# EAGLE design master-board (EAGLE 8.7.0)
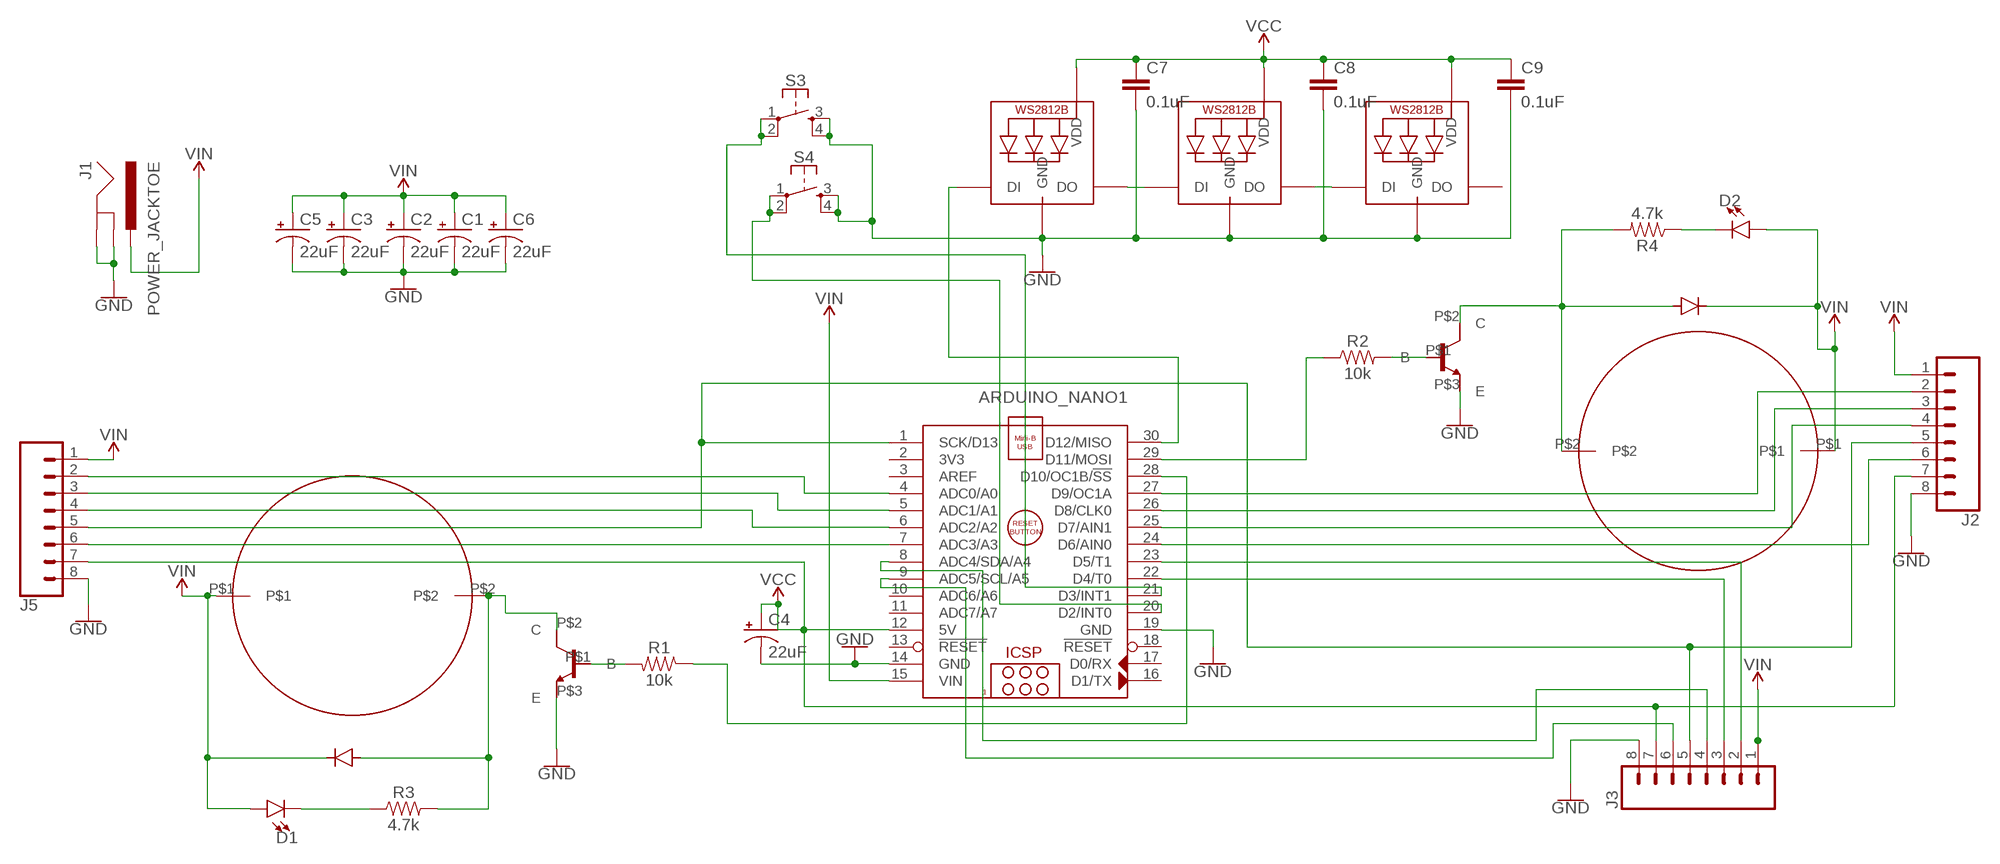
[diagram p0: schematic, sheet 1]

## Parts
ARDUINO_NANO1  ARDUINO_NANO  [ARDUINO_NANO]
C1  22uF  22UF-POLAR-PANASONIC_C-35V-20%  [PANASONIC_C]
C2  22uF  22UF-POLAR-PANASONIC_C-35V-20%  [PANASONIC_C]
C3  22uF  22UF-POLAR-PANASONIC_C-35V-20%  [PANASONIC_C]
C4  22uF  22UF-POLAR-PANASONIC_C-35V-20%  [PANASONIC_C]
C5  22uF  22UF-POLAR-PANASONIC_C-35V-20%  [PANASONIC_C]
C6  22uF  22UF-POLAR-PANASONIC_C-35V-20%  [PANASONIC_C]
C7  0.1uF  0.1UF-0603-25V-(+80/-20%)  [0603]
C8  0.1uF  0.1UF-0603-25V-(+80/-20%)  [0603]
C9  0.1uF  0.1UF-0603-25V-(+80/-20%)  [0603]
D1  LED0603  [LED-0603]
D2  LED0603  [LED-0603]
J1  POWER_JACKTOE  [POWER_JACK_SMD_OVERPASTE_TOE]
J2  CONN_08"  [1X08]
J3  CONN_08"  [1X08]
J5  CONN_08"  [1X08]
LED1  WS2812B5050  [WS2812B]
LED2  WS2812B5050  [WS2812B]
LED3  WS2812B5050  [WS2812B]
R1  10k  10KOHM-0603-1/10W-1%  [0603]
R2  10k  10KOHM-0603-1/10W-1%  [0603]
R3  4.7k  4.7KOHM-0603-1/10W-1%  [0603]
R4  4.7k  4.7KOHM-0603-1/10W-1%  [0603]
S3  MOMENTARY-SWITCH-SPST-2-SMD-4.6X2.8MM  [TACTILE_SWITCH_SMD_4.6X2.8MM]
S4  MOMENTARY-SWITCH-SPST-2-SMD-4.6X2.8MM  [TACTILE_SWITCH_SMD_4.6X2.8MM]
U$1  AIYIMA-PUMP-A5F083  [A5F083]
U$2  AIYIMA-PUMP-A5F083  [A5F083]
U$3  IN4148  [IN4148]
U$4  IN4148  [IN4148]
U$5  TIP120-TO220  [TO220]
U$6  TIP120-TO220  [TO220]

## Nets
GND: ARDUINO_NANO1.14(GND) ARDUINO_NANO1.19(GND) C1.- C2.- C3.- C4.- C5.- C6.- C7.2 C8.2 C9.2 J1.GND(GNDBREAK) J1.P$4(GND) J2.8 J3.8 J5.8 LED1.3-GND(GND) LED2.3-GND(GND) LED3.3-GND(GND) S3.3 S3.4 S4.3 S4.4 U$5.P$3(E) U$6.P$3(E)
N$1: ARDUINO_NANO1.29(D11/MOSI) R2.1
N$2: R1.2 U$6.P$1(B)
N$3: ARDUINO_NANO1.23(D5/T1) J3.2
N$4: ARDUINO_NANO1.22(D4/T0) J3.3
N$5: R3.2 U$1.P$2 U$3.P$2 U$6.P$2(C)
N$6: R4.2 U$2.P$2 U$4.P$2 U$5.P$2(C)
N$7: R2.2 U$5.P$1(B)
N$8: ARDUINO_NANO1.30(D12/MISO) LED1.4-DIN(DI)
N$9: ARDUINO_NANO1.8(ADC4/SDA/A4) J3.4
N$10: ARDUINO_NANO1.28(D10/OC1B/!SS) R1.1
N$11: ARDUINO_NANO1.5(ADC1/A1) J5.3
N$12: D1.C R3.1
N$13: ARDUINO_NANO1.1(SCK/D13) J2.5 J3.5 J5.5
N$14: ARDUINO_NANO1.7(ADC3/A3) J5.6
N$15: ARDUINO_NANO1.9(ADC5/SCL/A5) J3.6
N$16: ARDUINO_NANO1.4(ADC0/A0) J5.2
N$17: D2.C R4.1
N$18: ARDUINO_NANO1.6(ADC2/A2) J5.4
N$20: ARDUINO_NANO1.20(D2/INT0) S4.1 S4.2
N$21: LED2.2-DOUT(DO) LED3.4-DIN(DI)
N$22: ARDUINO_NANO1.24(D6/AIN0) J2.6
N$23: ARDUINO_NANO1.25(D7/AIN1) J2.4
N$24: ARDUINO_NANO1.26(D8/CLK0) J2.3
N$25: ARDUINO_NANO1.27(D9/OC1A) J2.2
N$26: LED1.2-DOUT(DO) LED2.4-DIN(DI)
N$29: ARDUINO_NANO1.21(D3/INT1) S3.1 S3.2
VCC: ARDUINO_NANO1.12(5V) C4.+ C7.1 C8.1 C9.1 J2.7 J3.7 J5.7 LED1.1-VDD(VDD) LED2.1-VDD(VDD) LED3.1-VDD(VDD)
VIN: ARDUINO_NANO1.15(VIN) C1.+ C2.+ C3.+ C5.+ C6.+ D1.A D2.A J1.VIN0(PWR) J2.1 J3.1 J5.1 U$1.P$1 U$2.P$1 U$3.P$1 U$4.P$1
Unconnected: ARDUINO_NANO1.2(3V3) ARDUINO_NANO1.3(AREF) ARDUINO_NANO1.10(ADC6/A6) ARDUINO_NANO1.11(ADC7/A7) ARDUINO_NANO1.13(!RESET) ARDUINO_NANO1.16(D1/TX) ARDUINO_NANO1.17(D0/RX) ARDUINO_NANO1.18(!RESET) LED3.2-DOUT(DO)

## Library data of the parts
ARDUINO_NANO1 = ArduinoNanoV30:ARDUINO_NANO: Arduino Nano V3.0 Module Overview: The Arduino Nano is a small, complete, and breadboard-friendly board based on the ATmega328 (Arduino Nano 3.x) or ATmega168 (Arduino Nano 2.x). It has more or less the same functionality of the Arduino Duemilanove, but in a different package. It lacks only a DC power jack, and works with a Mini-B USB cable instead of a standard one. The Nano was designed and is being produced by Gravitech <http://www.gravitech.us/arna30wiatp.html>. General specifications: Item Value Microcontroller Atmel ATmega168 or ATmega328 Operating Voltage (logic level) 5 V Input Voltage (recommended) 7-12 V Input Voltage (limits) 6-20 V Digital I/O Pins 14 (of which 6 provide PWM output) Analog Input Pins 8 DC Current per I/O Pin 40 mA Flash Memory 16 KB (ATmega168) or 32 KB (ATmega328) of which 2 KB used by bootloader SRAM 1 KB (ATmega168) or 2 KB (ATmega328) EEPROM 512 bytes (ATmega168) or 1 KB (ATmega328) Clock Speed 16 MHz Dimensions (Inches) 0.73" x 1.70" Dimensions (mm) 18mm x 45mm Overall height About 9 mm (not including pins) Weigth 5 g Power: The Arduino Nano can be powered via the Mini-B USB connection, 6-20V unregulated external power supply (pin 30), or 5V regulated external power supply (pin 27). The power source is automatically selected to the highest voltage source. Memory: The ATmega168 has 16 KB of flash memory for storing code (of which 2 KB is used for the bootloader); the ATmega328 has 32 KB, (also with 2 KB used for the bootloader). The ATmega168 has 1 KB of SRAM and 512 bytes of EEPROM (which can be read and written with the EEPROM library); the ATmega328 has 2 KB of SRAM and 1 KB of EEPROM. Input and Output: Each of the 14 digital pins on the Nano can be used as an input or output, using pinMode(), digitalWrite(), and digitalRead() functions. They operate at 5 volts. Each pin can provide or receive a maximum of 40 mA and has an internal pull-up resistor (disconnected by default) of 20-50 kOhms. In addition, some pins have specialized functions. Visit Arduino - ArduinoBoardNano <https://www.arduino.cc/en/Main/ArduinoBoardNano>
C1-C6 = SparkFun-Capacitors:22UF-POLAR: 22µF polarized capacitors A capacitor is a passive two-terminal electrical component used to store electrical energy temporarily in an electric field.; PROD_ID: CAP-08618
C7-C9 = SparkFun-Capacitors:0.1UF: 0.1µF ceramic capacitors A capacitor is a passive two-terminal electrical component used to store electrical energy temporarily in an electric field.; PROD_ID: CAP-00810
D1 D2 = SparkFun-LED:LED: LED (Generic) Standard schematic elements and footprints for 5mm, 3mm, 1206, and 0603 sized LEDs. Generic LEDs with no color specified.
J1 = SparkFun-Connectors:POWER_JACK: Power Jack Connector This is the standard 5.5mm barrel jack for power. The PTH is the most common, proven, reliable, footprint. The Slot footprint only works if the mill layer is transmitted to the PCB fab house so be warned. Here are the connectors we sell at SparkFun: DC Barrel Power Jack/Connector <https://www.sparkfun.com/products/119> (PRT-00119) DC Barrel Power Jack/Connector (SMD) <https://www.sparkfun.com/products/12748> (PRT-12748) DC Barrel Jack Adapter - Breadboard Compatible <https://www.sparkfun.com/products/10811> (PRT-10811) It is used on this SparkFun product (and many, many others): SparkFun RedBoard - Programmed with Arduino <https://www.sparkfun.com/products/12757> (DEV-12757) Also, if you need a mating power supply or connector, please check these out: Wall Adapter Power Supply - 9VDC 650mA <https://www.sparkfun.com/products/298> (TOL-00298) DC Barrel Jack Adapter - Male <https://www.sparkfun.com/products/10287> (PRT-10287); PROD_ID: CONN-08106; SF_ID: PRT-12748
J2 J3 J5 = SparkFun-Connectors:CONN_08: Multi connection point. Often used as Generic Header-pin footprint for 0.1 inch spaced/style header connections On any of the 0.1 inch spaced packages, you can populate with these: Break Away Headers - Straight <https://www.sparkfun.com/products/116> (PRT-00116) Break Away Male Headers - Right Angle <https://www.sparkfun.com/products/553> (PRT-00553) Female Headers <https://www.sparkfun.com/products/115> (PRT-00115) Break Away Headers - Machine Pin <https://www.sparkfun.com/products/117> (PRT-00117) Break Away Female Headers - Swiss Machine Pin <https://www.sparkfun.com/products/743> (PRT-00743) Arduino Stackable Header - 8 Pin <https://www.sparkfun.com/products/9279> (PRT-09279) For SCREWTERMINALS and SPRING TERMINALS visit here: Screw Terimnals on SparkFun.com <https://www.sparkfun.com/search/results?term=Screw+Terminals> (5mm/3.5mm/2.54mm spacing) This device is also useful as a general connection point to wire up your design to another part of your project. Our various solder wires solder well into these plated through hole pads. Hook-Up Wire - Assortment (Stranded, 22 AWG) <https://www.sparkfun.com/products/11375> (PRT-11375) Hook-Up Wire - Assortment (Solid Core, 22 AWG) <https://www.sparkfun.com/products/11367> (PRT-11367) View the entire wire category on our website here <https://www.sparkfun.com/categories/141> Special notes: Molex polarized connector foot print use with SKU : PRT-08231 with associated crimp pins and housings. 1MM SMD Version SKU: PRT-10208 NOTES ON THE VARIANTS LOCK and LOCK_LONGPADS... This footprint was designed to help hold the alignment of a through-hole component (i.e. 6-pin header) while soldering it into place. You may notice that each hole has been shifted either up or down by 0.005 of an inch from it's more standard position (which is a perfectly straight line). This slight alteration caused the pins (the squares in the middle) to touch the edges of the holes. Because they are alternating, it causes a "brace" to hold the component in place. 0.005 has proven to be the perfect amount of "off-center" position when using our standard breakaway headers. Although looks a little odd when you look at the bare footprint, once you have a header in there, the alteration is very hard to notice. Also,if you push a header all the way into place, it is covered up entirely on the bottom side.; PROD_ID: CONN-08438
LED1-LED3 = adafruit:WS2812B
R1 R2 = SparkFun-Resistors:10KOHM: 10kΩ resistor A resistor is a passive two-terminal electrical component that implements electrical resistance as a circuit element. Resistors act to reduce current flow, and, at the same time, act to lower voltage levels within circuits. - Wikipedia; PROD_ID: RES-00824
R3 R4 = SparkFun-Resistors:4.7KOHM: 4.7kΩ resistor A resistor is a passive two-terminal electrical component that implements electrical resistance as a circuit element. Resistors act to reduce current flow, and, at the same time, act to lower voltage levels within circuits. - Wikipedia; PROD_ID: RES-07857
S3 S4 = SparkFun-Switches:MOMENTARY-SWITCH-SPST-2: Momentary Switch (Pushbutton) - SPST - Two Circuits Normally-open (NO) SPST momentary switches (buttons, pushbuttons). Schematic symbol includes two switch circuits. Variants SMD-4.6MMX2.8MM - 4.60mm x 2.80mm Tactile Momentary Button Switch - Used on SparkFun SAMD21 Mini Breakout <https://www.sparkfun.com/products/13664> SMD-5.2MM - Mini Pushbutton Switch - SMD <https://www.sparkfun.com/products/8720> - Used on Arduino Pro Mini <https://www.sparkfun.com/products/11114>; PROD_ID: SWCH-13065
U$1 U$2 = programmable-air-components:AIYIMA-PUMP-A5F083: Aiyima company vacuum/high pressure air pump. 12V, 0.35A, 3LPM
U$3 U$4 = programmable-air-components:IN4148
U$5 U$6 = programmable-air-components:TIP120-TO220

## Board
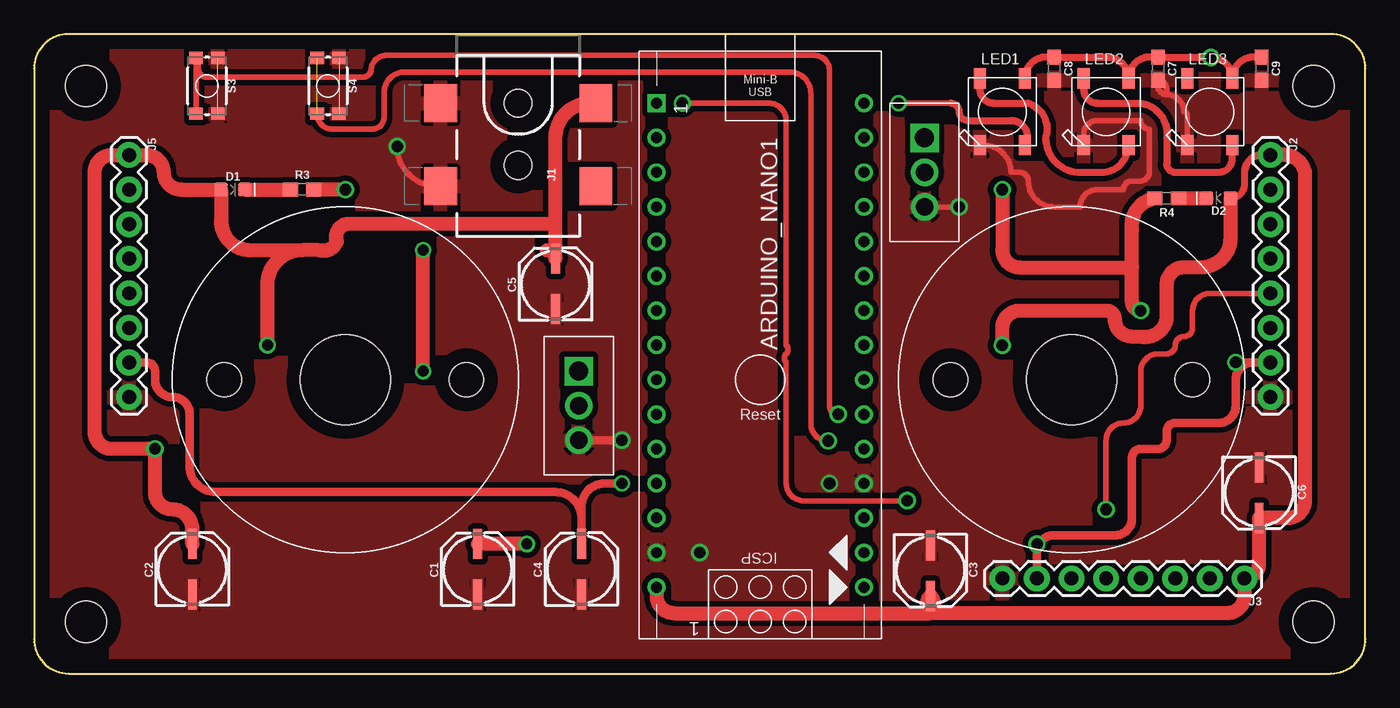
[diagram p1: board, top side]
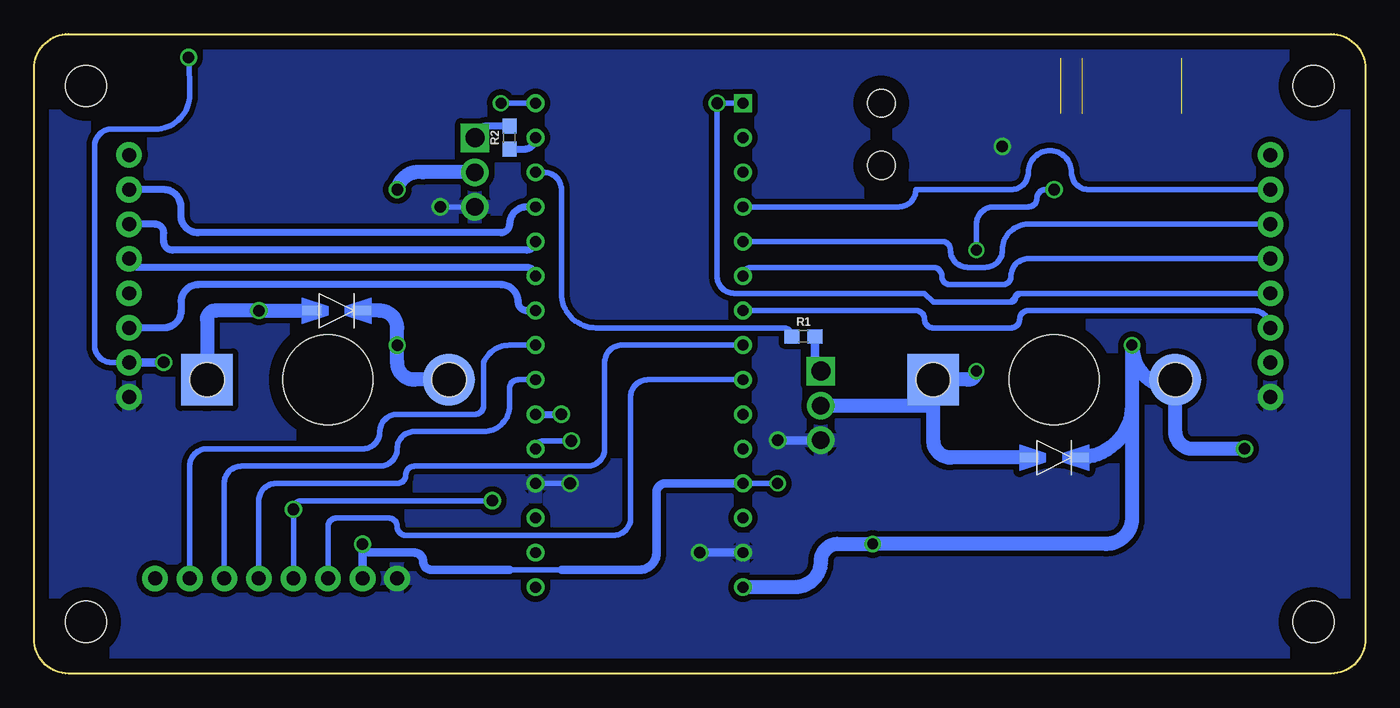
[diagram p2: board, bottom side, seen from below]

Size 97.79 x 46.99 mm. Coordinates in mm from the lower left corner, seen from the top.
Outline: 0,44.45 0,2.54 arc90 2.54,0 95.25,0 arc90 97.79,2.54 97.79,44.45 arc90 95.25,46.99 2.54,46.99 arc90 0,44.45
Copper layers (1*16): Top 0.035mm / dielectric 1.5mm / Bottom 0.035mm
Design rules "default *": minimum track width 6mil, minimum drill 0.35mm, track to track 16mil, track to pad 16mil, pad to pad 16mil, via to via 16mil, smd to smd 16mil, copper to edge 40mil, drill to drill 6mil, minimum pad ring 10mil, minimum via ring 8mil, stop-mask expansion 4mil, vias tented up to drill 0mil, thermal gap 10mil
Holes 3.05 mm at 3.81,43.18 3.81,3.81 93.98,3.81 93.98,43.18
tKeepout: area 91.4,40.6 to 97.8,47; area 91.4,0 to 97.8,6.3; area 0,40.6 to 6.3,47; area 0,0 to 6.3,6.3; area 10.2,8.9 to 35.6,34.3; area 63.5,8.9 to 88.9,34.3
bKeepout: area 0,0 to 6.3,6.3; area 0,40.6 to 6.3,47; area 91.4,40.6 to 97.8,47; area 91.4,0 to 97.8,6.3

### Footprints (pad centres in the part's own frame; a part is rotated, then mirrored left to right if it is on the bottom)
ARDUINO_NANO = drill 0.8 square: 1 -20.32,-7.62 | drill 0.8: 2 -17.78,-7.62; 3 -15.24,-7.62; 4 -12.7,-7.62; 5 -10.16,-7.62; 6 -7.62,-7.62; 7 -5.08,-7.62; 8 -2.54,-7.62; 9 0,-7.62; 10 2.54,-7.62; 11 5.08,-7.62; 12 7.62,-7.62; 13 10.16,-7.62; 14 12.7,-7.62; 15 15.24,-7.62; 16 15.24,7.62; 17 12.7,7.62; 18 10.16,7.62; 19 7.62,7.62; 20 5.08,7.62; 21 2.54,7.62; 22 0,7.62; 23 -2.54,7.62; 24 -5.08,7.62; 25 -7.62,7.62; 26 -10.16,7.62; 27 -12.7,7.62; 28 -15.24,7.62; 29 -17.78,7.62; 30 -20.32,7.62
PANASONIC_C = smd 2.2 x 0.65: + 1.9,-0.2; - -1.8,-0.2
0603 = smd 1.1 x 1: 1 -0.85,0; 2 0.85,0
LED-0603 = smd 1 x 1: A -0.877,0; C 0.877,0
POWER_JACK_SMD_OVERPASTE_TOE = smd 2.8 x 2.4: GND 0,-5.7; P$4 6.1,-5.7; VIN0 0,5.7; VIN1 6.1,5.7 | hole 2.032: 0,0; 4.572,0
1X08 = drill 1.016 pad 1.88: 1 0,0; 2 2.54,0; 3 5.08,0; 4 7.62,0; 5 10.16,0; 6 12.7,0; 7 15.24,0; 8 17.78,0
WS2812B = smd 1.5 x 0.9: 1-VDD 2.45,-1.65; 2-DOUT 2.45,1.65; 3-GND -2.45,1.65; 4-DIN -2.45,-1.65
TACTILE_SWITCH_SMD_4.6X2.8MM = smd 0.9 x 1: 1 -2.05,-0.8; 2 2.05,-0.8; 3 2.05,0.8; 4 -2.05,0.8
A5F083 = smd 3.81 x 3.81 bottom: P$1 -8.89,0; P$2 8.89,0 | hole 6.604: 0,0 | hole 2.54: -8.89,0; 8.89,0
IN4148 = smd 1.422 x 0.711: P$1 1.829,0; P$2 -1.829,0
TO220 = drill 1.397 pad 2.032 square: P$1 -2.54,0 | drill 1.27 pad 2.032: P$2 0,0; P$3 2.54,0

### Placement (x,y rotation side)
ARDUINO_NANO1  53.34,21.59 270 top
C1  32.38,7.62 90 top
C2  11.43,7.62 90 top
C3  66.04,7.62 270 top
C4  40.01,7.62 90 top
C5  38.1,28.57 90 top
C6  90.17,13.34 270 top
C7  82.55,44.45 270 top
C8  74.93,44.45 270 top
C9  90.17,44.45 270 top
D1  14.61,35.56 0 top
D2  87,34.92 180 top
J1  35.56,41.91 270 top
J2  90.81,38.1 270 top
J3  88.9,6.99 180 top
J5  6.99,38.1 270 top
LED1  71.12,41.27 90 top
LED2  78.74,41.27 90 top
LED3  86.36,41.27 90 top
R1  41.27,24.77 0 bottom
R2  62.87,39.37 90 bottom
R3  19.68,35.56 0 top
R4  83.19,34.92 180 top
S3  12.7,43.18 270 top
S4  21.59,43.18 270 top
U$1  22.86,21.59 0 top
U$2  76.2,21.59 0 top
U$3  22.86,15.88 0 bottom
U$4  75.56,26.67 0 bottom
U$5  65.41,36.83 270 top
U$6  40.01,19.68 270 top

### Tracks (layer width: path | path; a pad name or v marks a point on that pad's centre or on a via)
GND  (via drill 0.85)  (2 unrouted)
  Top 0.406: LED2.3-GND 77.09,39.62 arc-90 78.11,40.64 81.28,40.64 arc90 81.92,40.01 81.92,36.83 arc-90 81.28,36.2 80.64,36.2 arc90 80.01,35.56 78.11,35.56 arc90 76.83,34.29 74.93,34.29 arc-90 73.03,36.2 arc90 72.39,36.83 71.75,36.83 arc90 69.76,38.83 LED1.3-GND | J1.P$4 29.59,35.81 arc-90 v26.67,38.73 | LED3.3-GND 84.71,41.02 arc90 84.45,41.27 arc90 83.19,42.55 | 83.19,42.55 83.19,42.97 arc90 C7.2 82.55,43.18 arc90 83.19,42.55 | U$5.P$3 v67.94,34.29
  Top 0.508: LED2.3-GND 77.09,38.99
  Top 0.635: U$6.P$3 v43.18,17.14
  Bottom 0.406: v67.94,34.29 U$5.P$3 | ARDUINO_NANO1.19 v58.42,13.97
  Bottom 0.635: v48.9,8.89 ARDUINO_NANO1.14 | U$6.P$3 v43.18,17.14
  pour Top: 0,2.54 0,44.45 arc-90 2.54,46.99 95.25,46.99 arc-90 97.79,44.45 97.79,2.54 arc-90 95.25,0 2.54,0 arc-90
  pour Bottom: 0,44.45 0,2.54 arc90 2.54,0 95.25,0 arc90 97.79,2.54 97.79,44.45 arc90 95.25,46.99 2.54,46.99 arc90
N$1
  Bottom 0.508: R2.1 61.81,38.52 arc-90 ARDUINO_NANO1.29
N$2
  Bottom 0.635: R1.2 40.42,22.64 arc-90 U$6.P$1
N$3
  Bottom 0.406: ARDUINO_NANO1.23 62.87,24.13 arc-67 64.77,22.86 64.77,19.68 arc90 65.41,19.05 71.12,19.05 arc-90 72.39,17.78 arc90 73.66,16.51 85.09,16.51 arc-90 86.36,15.24 J3.2
N$4
  Bottom 0.406: J3.3 83.82,13.97 arc90 82.55,15.24 72.39,15.24 arc-90 71.12,16.51 arc90 69.85,17.78 64.77,17.78 arc-90 62.87,19.68 62.87,20.95 arc90 62.23,21.59 ARDUINO_NANO1.22
N$5  (via drill 0.8, 0.85)
  Top 1.016: v28.57,22.23 v28.57,31.11 | v22.86,35.56 R3.2
  Bottom 0.406: v22.86,35.56 23.5,35.56 arc-90 24.13,34.92 arc90 24.77,34.29 27.3,34.29 arc-90 28.57,33.02 v28.57,31.11
  Bottom 1.016: U$3.P$2 30.48,15.88 | 30.48,15.88 arc90 31.75,17.14 | 31.75,17.14 31.75,19.68 | U$1.P$2 31.75,22.23 | U$6.P$2 31.75,19.68 | 29.21,21.59 arc-90 v28.57,22.23 arc90 29.21,21.59 | 29.21,21.59 U$1.P$2 | U$1.P$2 31.75,19.68 | 31.75,17.14 arc-90 30.48,15.88
N$6  (via drill 0.85)
  Top 1.016: v81.28,26.67 arc-90 80.64,27.3 80.64,29.84 | 80.64,29.84 72.39,29.84 arc-90 71.12,31.11 v71.12,35.56 | 80.64,29.84 80.64,32.6 arc-90 R4.2
  Bottom 1.016: U$2.P$2 85.09,26.04 arc90 84.45,26.67 v81.28,26.67 U$4.P$2 | U$5.P$2 69.22,36.83 arc-90 v71.12,35.56
N$7
  Bottom 0.508: R2.2 64.56,40.22 arc-90 U$5.P$1
N$8  (via drill 0.8)
  Top 0.406: v63.5,41.91 67.31,41.91
  Top 0.508: LED1.4-DIN arc122 71.75,40.64 68.58,40.64 arc-90 67.94,41.27 arc90 67.31,41.91
  Bottom 0.406: ARDUINO_NANO1.30 v63.5,41.91
N$9
  Bottom 0.406: ARDUINO_NANO1.8 54.61,24.13 arc-90 55.88,22.86 55.88,16.51 arc90 57.15,15.24 69.85,15.24 arc-90 70.48,14.61 arc90 71.12,13.97 80.01,13.97 arc-90 81.28,12.7 J3.4
N$10
  Bottom 0.406: R1.1 arc-90 42.76,25.4 56.52,25.4 arc90 59.05,27.94 59.05,35.56 arc-90 60.33,36.83 ARDUINO_NANO1.28
N$11
  Bottom 0.406: ARDUINO_NANO1.5 31.11,31.75 arc90 30.48,31.11 arc-90 29.21,29.84 27.94,29.84 arc-90 26.67,31.11 arc90 24.77,33.02 J5.3
N$12
  Top 1.016: D1.C R3.1
N$13  (via drill 0.85)
  Top 0.406: v47.62,41.91 53.98,41.91 arc-90 55.24,40.64 55.24,24.13 arc-90 55.24,23.5 arc90 55.24,22.86 55.24,13.97 arc90 56.52,12.7 v64.14,12.7 | v78.74,12.06 78.74,17.14 arc-90 80.01,18.41 arc90 81.28,19.68 81.28,22.23 arc-90 82.55,23.5 83.19,23.5 arc90 83.82,24.13 arc-90 84.45,24.77 arc90 85.09,25.4 85.09,26.67 arc-90 86.36,27.94 J2.5
  Bottom 0.406: J3.5 v78.74,12.06 arc90 78.11,12.7 v64.14,12.7 | 26.04,27.3 25.72,27.62 | 25.72,27.62 25.4,27.94 | 25.4,27.94 J5.5 | 25.4,27.94 arc-90 25.72,27.62 | 26.04,27.3 arc-90 25.72,27.62 | 26.04,27.3 31.75,27.3 32.38,27.94 46.35,27.94 arc90 47.62,29.21 v47.62,41.91 ARDUINO_NANO1.1
N$14
  Bottom 0.406: J5.6 arc-90 8.26,26.67 24.77,26.67 arc-90 25.4,26.04 arc90 26.04,25.4 31.75,25.4 arc90 32.38,26.04 arc-90 33.02,26.67 ARDUINO_NANO1.7
N$15
  Bottom 0.406: ARDUINO_NANO1.9 52.7,21.59 arc-90 53.98,20.32 53.98,11.43 arc90 55.24,10.16 70.48,10.16 arc90 71.12,10.79 arc-90 71.75,11.43 75.56,11.43 arc-90 76.2,10.79 J3.6
N$16
  Bottom 0.406: J5.2 20.32,35.56 arc90 21.59,36.83 arc-180 24.77,36.83 arc90 26.04,35.56 33.02,35.56 arc90 34.29,34.29 ARDUINO_NANO1.4
N$17
  Top 1.016: R4.1 D2.C
N$18
  Bottom 0.406: J5.4 24.77,30.48 arc-90 26.04,29.21 arc90 26.67,28.57 30.48,28.57 arc90 31.11,29.21 arc-90 31.75,29.84 45.09,29.84 arc-90 ARDUINO_NANO1.6
N$20  (via drill 0.85)  (1 unrouted)
  Top 0.406: S4.2 arc90 21.91,40.01 24.87,40.01 arc90 25.7,40.84 25.7,42.67 arc-90 27.23,44.2 55.5,44.2 arc-90 57.05,42.65 57.05,18.36 arc90 v58.32,17.09
  Bottom 0.406: 60.91,16.46 arc90 ARDUINO_NANO1.20 arc90 60.38,17.09 v58.32,17.09
N$21
  Top 0.508: LED2.2-DOUT 77.09,42.92 arc90 78.11,41.91 81.28,41.91 arc-90 83.19,39.37 83.19,37.47 arc90 83.82,36.83 87,36.83 arc90 88.01,37.84 LED3.4-DIN
N$22
  Bottom 0.508: ARDUINO_NANO1.24 61.59,26.67 arc90 62.23,27.3 arc-90 63.5,28.57 85.72,28.57 arc-90 87,27.3 87,26.67 arc90 88.27,25.4 J2.6
N$23
  Bottom 0.508: ARDUINO_NANO1.25 arc-90 61.59,29.84 90.17,29.84 arc90 J2.4
N$24
  Bottom 0.508: ARDUINO_NANO1.26 arc90 61.59,31.11 87.63,31.11 arc90 88.27,31.75 88.27,32.38 arc-90 88.9,33.02 J2.3
N$25
  Bottom 0.508: ARDUINO_NANO1.27 61.59,34.29 arc-90 62.87,33.02 arc90 63.5,32.38 85.72,32.38 arc90 87,33.66 87,34.29 arc-90 88.27,35.56 J2.2
N$26
  Top 0.508: LED1.2-DOUT 69.47,42.92 arc90 70.48,41.91 73.03,41.91 arc-90 74.3,39.37 arc90 76.83,36.83 78.39,36.83 arc90 LED2.4-DIN
N$29  (via drill 0.85)
  Top 0.406: v59.05,19.05 arc-90 58.42,19.68 58.42,44.45 arc90 57.15,45.41 26.04,45.41 arc90 24.77,44.45 arc-90 24.13,43.81 12.7,43.81 arc-90 12.06,44.45 12.06,45.06 arc90 S3.1 S3.2
  Bottom 0.508: ARDUINO_NANO1.21 v59.05,19.05
VCC  (via drill 0.8, 0.85)
  Top 0.406: 86.44,45.3 v86.44,45.26
  Top 0.508: LED1.1-VDD arc-90 74.34,45.3 C8.1 78.81,45.3 arc-90 LED2.1-VDD arc-90 81.97,45.3 C7.1 86.44,45.3 arc-90 LED3.1-VDD arc-90 89.58,45.3 C9.1
  Top 0.635: J3.7 73.66,8.89 arc-90 74.93,10.16 79.38,10.16 arc90 80.64,11.43 80.64,15.88 arc-90 81.28,16.51 82.55,16.51 arc90 83.19,17.14 83.19,17.78 arc-90 83.82,18.41 87,18.41 arc90 88.27,19.68 88.27,21.59 arc-90 89.53,22.86 J2.7 v88.27,22.86 | J5.7 8.26,22.86 arc-90 8.89,22.23 8.89,21.59 arc90 10.16,20.32 arc-90 11.43,19.05 11.43,15.24 arc90 13.34,13.34 38.3,13.34 arc-90 40.2,11.43 C4.+ 40.2,12.27 arc-90 41.91,13.97 v43.18,13.97
  Bottom 0.406: J2.7 92.08,22.86 arc90 93.34,24.13 93.34,38.73 arc90 92.08,40.01 88.9,40.01 arc-90 86.36,42.55 arc-3 v86.44,45.26 | 62.87,7.62 59.05,7.62 | ARDUINO_NANO1.12 v43.18,13.97
  Bottom 0.635: J2.7 v88.27,22.86 | ARDUINO_NANO1.12 51.44,13.97 arc-90 52.07,13.34 52.07,8.89 arc90 53.34,7.62 59.05,7.62 | 62.87,7.62 68.58,7.62 arc90 69.22,8.26 arc-90 69.85,8.89 73.03,8.89 arc90 v73.66,9.53 J3.7
VIN  (via drill 0.8, 0.85)
  Top 0.508: J2.1 90.17,38.1 arc90 88.9,36.83 88.9,35.95 arc-90 D2.A
  Top 1.016: v71.12,24.13 71.12,25.4 arc-90 72.39,26.67 78.74,26.67 arc-90 79.38,26.04 arc90 80.64,24.77 81.28,24.77 arc90 83.19,26.04 83.19,28.57 arc-90 84.45,29.84 85.72,29.84 arc90 87.87,31.99 D2.A | J2.1 91.44,38.1 arc-90 93.34,36.83 93.34,12.7 arc-90 92.08,11.43 C6.+ arc-90 C6.+ 89.97,8.05 arc-90 J3.1 88.9,5.71 arc-90 87.63,4.45 65.84,4.45 arc-90 C3.+ arc-90 65.83,4.45 46.99,4.45 arc-90 45.72,5.71 ARDUINO_NANO1.15 arc-90 ARDUINO_NANO1.15 | 38.3,33.02 C5.+ arc90 37.66,31.11 | 38.3,33.02 38.3,39.37 arc-90 40.84,41.91 J1.VIN0 | v17.14,24.13 17.14,28.57 arc-90 19.68,31.11 | 19.68,31.11 15.88,31.11 arc-90 13.73,33.26 D1.A 10.79,35.56 arc-90 9.53,36.83 arc90 8.26,38.1 J5.1 5.71,38.1 arc90 4.45,36.83 4.45,17.78 arc90 5.71,16.51 v8.89,16.51 arc90 v8.88,16.5 8.88,13.34 arc90 10.16,12.06 arc-90 11.63,10.6 C2.+ | 38.3,33.02 22.86,33.02 arc90 22.23,31.75 arc-90 20.95,31.11 19.68,31.11 | v36.2,9.53 C1.+ arc90 C1.+
  Bottom 1.016: U$4.P$1 72.39,26.67 arc90 71.12,25.4 v71.12,24.13 71.12,22.86 arc-90 69.85,21.59 U$2.P$1 | v8.89,16.51 12.7,16.51 arc90 13.97,17.78 13.97,20.95 | 13.97,20.95 U$1.P$1 | v17.14,24.13 arc-90 13.97,20.95 | v17.14,24.13 17.14,19.76 arc90 U$3.P$1 | v17.14,24.13 17.14,11.43 arc90 19.05,9.53 v36.2,9.53 38.73,9.53 arc-90 40.01,8.26 arc90 41.91,6.35 ARDUINO_NANO1.15